# EAGLE design LilyPad_LED_5pcs (EAGLE 7.5.0)
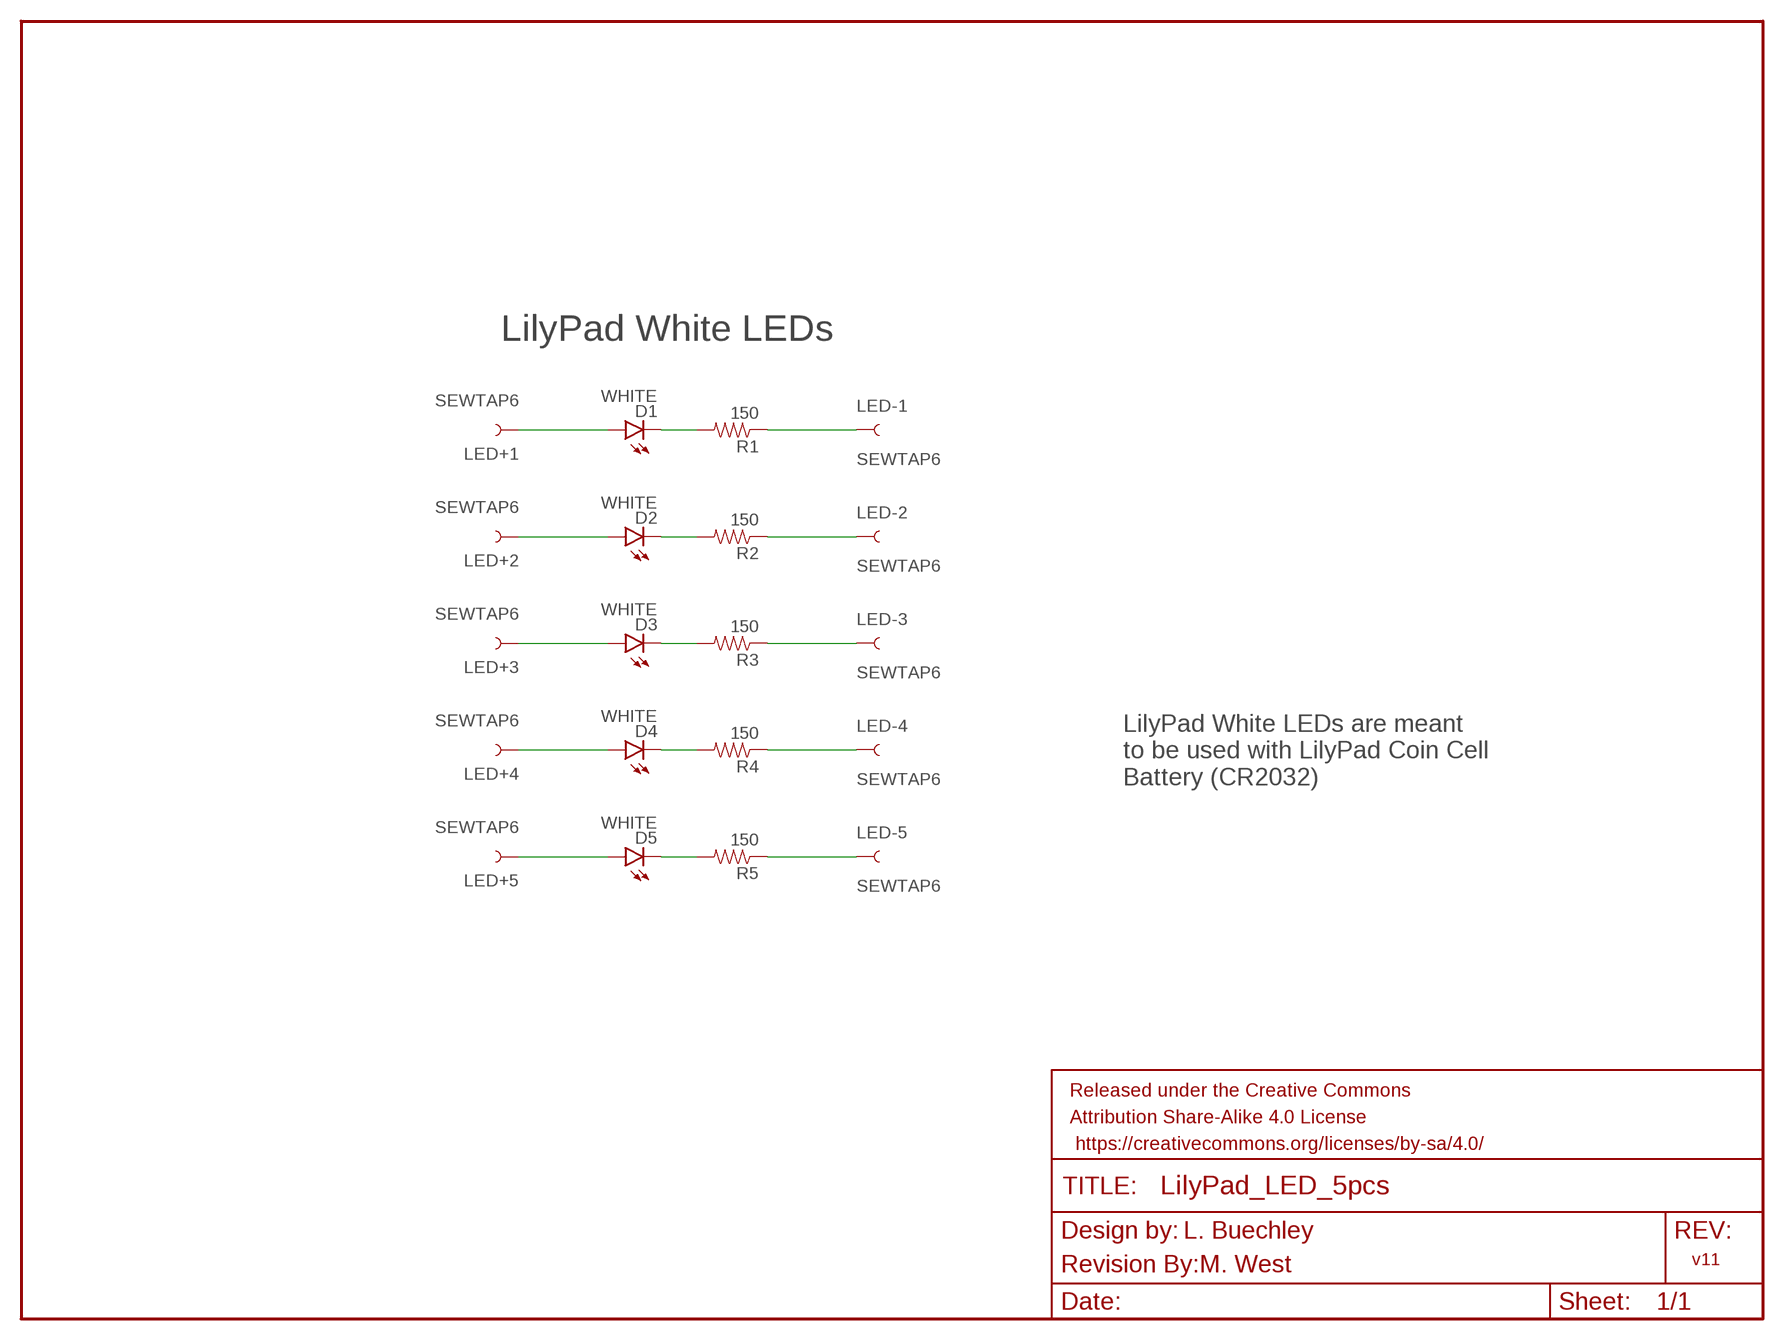
[diagram p0: schematic, sheet 1]

## Parts
D1  WHITE  LED-WHITE1206  [LED-1206]
D2  WHITE  LED-WHITE1206  [LED-1206]
D3  WHITE  LED-WHITE1206  [LED-1206]
D4  WHITE  LED-WHITE1206  [LED-1206]
D5  WHITE  LED-WHITE1206  [LED-1206]
FRAME1  FRAME-LETTER  [CREATIVE_COMMONS]
LED+1  SEWTAP6  [PETAL-SMALL-2SIDE]
LED+2  SEWTAP6  [PETAL-SMALL-2SIDE]
LED+3  SEWTAP6  [PETAL-SMALL-2SIDE]
LED+4  SEWTAP6  [PETAL-SMALL-2SIDE]
LED+5  SEWTAP6  [PETAL-SMALL-2SIDE]
LED-1  SEWTAP6  [PETAL-SMALL-2SIDE]
LED-2  SEWTAP6  [PETAL-SMALL-2SIDE]
LED-3  SEWTAP6  [PETAL-SMALL-2SIDE]
LED-4  SEWTAP6  [PETAL-SMALL-2SIDE]
LED-5  SEWTAP6  [PETAL-SMALL-2SIDE]
R1  150  150OHM-1/10W-1%(0603)  [0603-RES]
R2  150  150OHM-1/10W-1%(0603)  [0603-RES]
R3  150  150OHM-1/10W-1%(0603)  [0603-RES]
R4  150  150OHM-1/10W-1%(0603)  [0603-RES]
R5  150  150OHM-1/10W-1%(0603)  [0603-RES]
U$6  REVISION  [REVISION]

## Nets
1: D1.A LED+1.1
2: D1.C R1.2
3: LED-1.1 R1.1
4: D2.A LED+2.1
5: D2.C R2.2
6: LED-2.1 R2.1
7: D3.A LED+3.1
8: D3.C R3.2
9: LED-3.1 R3.1
10: D4.A LED+4.1
11: D4.C R4.2
12: LED-4.1 R4.1
13: D5.A LED+5.1
14: D5.C R5.2
15: LED-5.1 R5.1

## Notes on the sheet
- LilyPad White LEDs
- LilyPad White LEDs are meant 
  to be used with LilyPad Coin Cell
  Battery (CR2032)
- L. Buechley
- v11
- M. West

## Library data of the parts
D1-D5 = SparkFun-LED:LED-WHITE: White SMD LEDs LilyPad 1206- DIO-09955; PROD_ID: DIO-09955
FRAME1 = SparkFun-Aesthetics:FRAME-LETTER: Schematic Frame Standard 8.5x11 US Letter frame
LED+1-LED+5 LED-1-LED-5 = LilyPad-Wearables:SEWTAP: Sew Taps for LilyPad Boards.
R1-R5 = SparkFun-Resistors:150OHM-1/10W-1%(0603): RES-11028; PROD-ID: 13326
U$6 = SparkFun-Aesthetics:REVISION

## Board
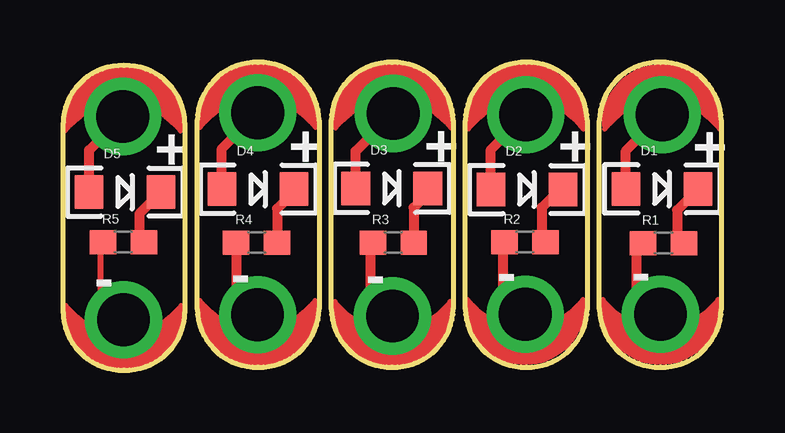
[diagram p1: board, top side]
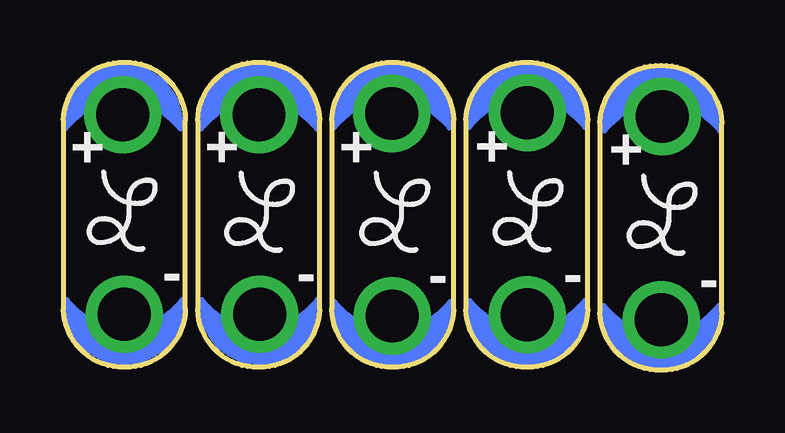
[diagram p2: board, bottom side, seen from below]

Size 27.43 x 12.83 mm. Coordinates in mm from the lower left corner, seen from the top.
Outline: 2.54,12.64 arc3 2.54,12.64
Outline: 2.54,0.06 arc3 2.54,0.06
Outline: 8.13,12.76 arc3 8.13,12.76
Outline: 13.71,12.76 arc3 13.72,12.76
Outline: 19.3,12.76 arc3 19.31,12.76
Outline: 5.08,10.29 arc90 2.54,12.7 arc90 0,10.29 0,2.41 arc90 2.54,0 arc90 5.08,2.41 5.08,10.29
Outline: 10.67,10.41 arc90 8.13,12.83 arc90 5.59,10.41 5.59,2.54 arc90 8.13,0.13 arc90 10.67,2.54 10.67,10.41
Outline: 16.26,10.41 arc90 13.72,12.83 arc90 11.18,10.41 11.18,2.54 arc90 13.72,0.13 arc90 16.26,2.54 16.26,10.41
Outline: 21.84,10.41 arc90 19.3,12.83 arc90 16.76,10.41 16.76,2.54 arc90 19.3,0.13 arc90 21.84,2.54 21.84,10.41
Outline: 27.43,10.41 arc90 24.89,12.83 arc90 22.35,10.41 22.35,2.54 arc90 24.89,0.13 arc90 27.43,2.54 27.43,10.41
Copper layers (1*16): Top 0.035mm / dielectric 1.5mm / Bottom 0.035mm
Design rules "SparkFun-2-layer-STANDARD": minimum track width 10mil, minimum drill 20mil, track to track 10mil, track to pad 8mil, pad to pad 8mil, via to via 10mil, smd to smd 8mil, copper to edge 8mil, drill to drill 8mil, minimum pad ring 10mil, minimum via ring 10mil, stop-mask expansion 4mil, vias tented up to drill 25mil, thermal gap 10mil

### Footprints (pad centres in the part's own frame; a part is rotated, then mirrored left to right if it is on the bottom)
LED-1206 = smd 1.2 x 1.4: A -1.5,0; C 1.5,0
PETAL-SMALL-2SIDE = drill 2.2: 1 0,0
0603-RES = smd 1.1 x 1: 1 -0.85,0; 2 0.85,0

### Placement (x,y rotation side)
D1  24.96,7.55 0 top
D2  19.33,7.53 0 top
D3  13.7,7.57 0 top
D4  8.12,7.54 0 top
D5  2.58,7.42 0 top
FRAME1  -7.19,-7.98 0 top  (outside the outline)
LED+1  24.96,10.64 180 top
LED+2  19.29,10.64 180 top
LED+3  13.76,10.7 180 top
LED+4  8.12,10.72 180 top
LED+5  2.49,10.57 180 top
LED-1  24.89,2.34 0 top
LED-2  19.26,2.34 0 top
LED-3  13.73,2.26 0 top
LED-4  8.11,2.31 0 top
LED-5  2.52,2.11 0 top
R1  25.02,5.29 0 top
R2  19.25,5.33 0 top
R3  13.76,5.31 0 top
R4  8.06,5.31 0 top
R5  2.52,5.33 0 top
U$1  [LOGO-L]  24.99,6.64 0 bottom
U$2  [LOGO-L]  19.26,6.6 0 bottom
U$3  [LOGO-L]  13.63,6.6 0 bottom
U$4  [LOGO-L]  8.07,6.61 0 bottom
U$5  [LOGO-L]  2.49,6.47 0 bottom
U$6  4.03,-10.7 0 top  (outside the outline)

### Tracks (layer width: path | path; a pad name or v marks a point on that pad's centre or on a via)
1
  Top 0.406: D1.A 23.46,9.13 LED+1.1
2
  Top 0.406: D1.C 26.46,7.54 25.58,6.67 25.58,5.57 R1.2
3
  Top 0.406: LED-1.1 23.91,3.32 23.91,5.03 R1.1
4
  Top 0.406: D2.A 17.83,9.19 LED+2.1
5
  Top 0.406: D2.C 20.7,7.53 19.95,6.77 19.95,5.48 R2.2
6
  Top 0.406: LED-2.1 18.34,3.25 18.34,5.28 R2.1
7
  Top 0.406: D3.A 12.2,9.13 LED+3.1
8
  Top 0.406: D3.C 15.2,7.35 14.61,6.77 R3.2
9
  Top 0.254: 12.81,5.21 R3.1
  Top 0.406: LED-3.1 12.81,3.17 12.81,5.21
10
  Top 0.406: D4.A 6.62,9.23 LED+4.1
11
  Top 0.406: D4.C 9.62,7.43 8.92,6.73 R4.2
12
  Top 0.406: R4.1 7.21,3.2 LED-4.1
13
  Top 0.406: D5.A 1.08,9.17 LED+5.1
14
  Top 0.406: D5.C 3.18,6.52 3.18,5.52 R5.2
15
  Top 0.254: 1.57,3.06 1.57,5.23 R5.1
  Top 0.406: 1.57,3.06 LED-5.1

### Text on the board
tPlace: + | + | + | + | + | - | - | - | - | -
bPlace: + | + | + | + | + | - | - | - | - | -
Measures: All Units Inches
tDocu: Board Thickness: 0.032" | Purple Solder Mask | L. Buechley | M. West | v11